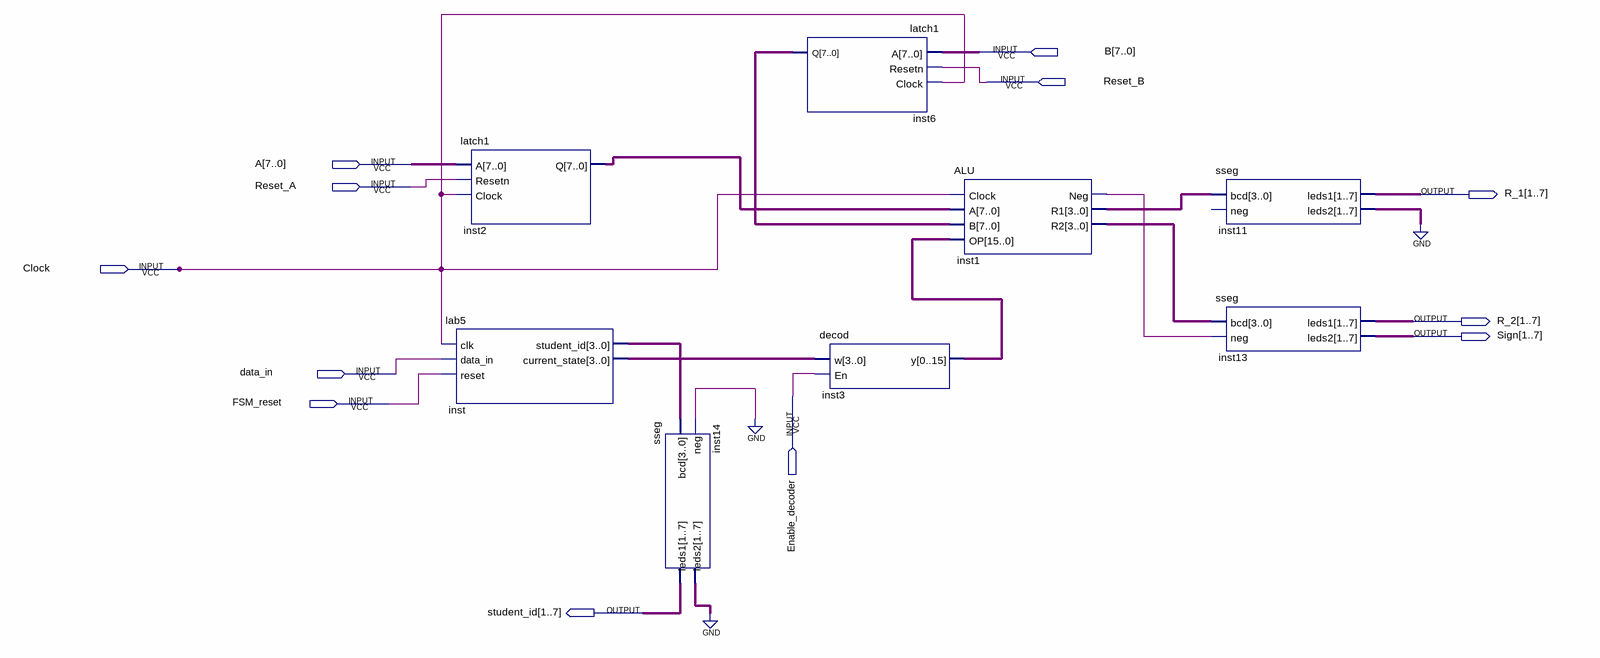
[diagram p0: schematic sheet]
// Quartus schematic GPU_Block.bdf as structural Verilog: 8 symbols, 12 pins
module GPU_Block (
  input  [7:0] B,
  input  Reset_B,
  input  [7:0] A,
  input  Reset_A,
  input  Clock,
  input  data_in,
  input  Enable_decoder,
  input  FSM_reset,
  output [1:7] R_1,
  output [1:7] R_2,
  output [1:7] Sign,
  output [1:7] student_id
);

  wire inst1_neg;
  wire [3:0] inst1_r1, inst1_r2, inst_current_state, inst_student_id;
  wire [6:0] inst11_leds2, inst14_leds2;
  wire [7:0] inst2_q, inst6_q;
  wire [15:0] inst3_y;

  latch1 inst2 (.A(A), .Resetn(Reset_A), .Clock(Clock), .Q(inst2_q));
  lab5 inst (
    .clk(Clock), .data_in(data_in), .reset(FSM_reset), .student_id(inst_student_id),
    .current_state(inst_current_state));
  sseg inst14 (.bcd(inst_student_id), .neg(1'b0), .leds1(student_id), .leds2(inst14_leds2));
  latch1 inst6 (.A(B), .Resetn(Reset_B), .Clock(Clock), .Q(inst6_q));
  decod inst3 (.w(inst_current_state), .En(Enable_decoder), .y(inst3_y));
  ALU inst1 (.Clock(Clock), .A(inst2_q), .B(inst6_q), .OP(inst3_y), .Neg(inst1_neg), .R1(inst1_r1), .R2(inst1_r2));
  sseg inst11 (.bcd(inst1_r1), .leds1(R_1), .leds2(inst11_leds2));  // open: neg
  sseg inst13 (.bcd(inst1_r2), .neg(inst1_neg), .leds1(R_2), .leds2(Sign));
  // also tied to GND on the sheet: {inst11_leds2[0], inst11_leds2[1], inst11_leds2[2], inst11_leds2[3], inst11_leds2[4], inst11_leds2[5], inst11_leds2[6], inst14_leds2[0], inst14_leds2[1], inst14_leds2[2], inst14_leds2[3], inst14_leds2[4], inst14_leds2[5], inst14_leds2[6]}
endmodule
